# EAGLE design SysnapseWriless-BOB-v1g (EAGLE 5.10)
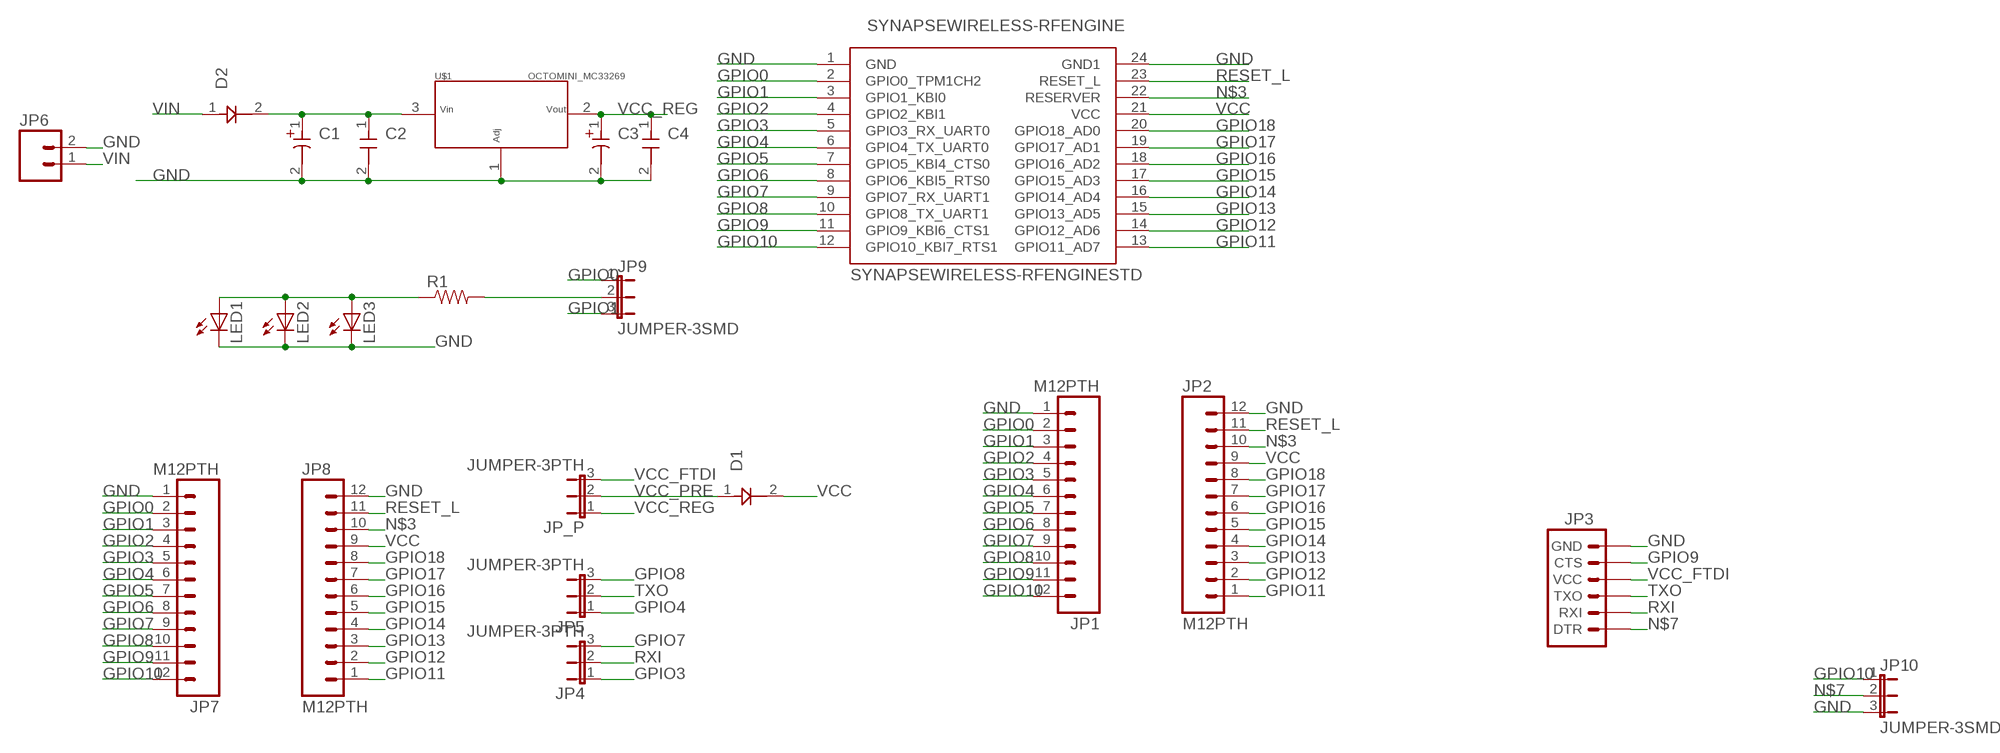
[diagram p0: schematic, sheet 1]

## Parts
C1  100uf  OCTOMINI_CAPDIELEC  [OCTOMINI_CAPDIELEC]
C2  100nf  OCTOMINI_CAPCERAM  [OCTOMINI_CAPCERAM]
C3  100uf  OCTOMINI_CAPDIELEC  [OCTOMINI_CAPDIELEC]
C4  100nf  OCTOMINI_CAPCERAM  [OCTOMINI_CAPCERAM]
D1  D1  OCTOMINI_DIODE  [OCTOMINI_DIODE]
D2  OCTOMINI_DIODE  [OCTOMINI_DIODE]
JP1  M12PTH  [1X12]
JP2  M12PTH  [1X12]
JP3  ARDUINO_SERIAL_PROGRAMPTH  [1X06]
JP4  JUMPER-3PTH  [1X03]
JP5  JUMPER-3PTH  [1X03]
JP6  M02PTH  [1X02]
JP7  M12PTH  [1X12]
JP8  M12PTH  [1X12]
JP9  JUMPER-3SMD  [SJ_3]
JP10  JUMPER-3SMD  [SJ_3]
JP_P  JUMPER-3PTH  [1X03]
LED1  LED0603  [LED-0603]
LED2  LED1206  [LED-1206]
LED3  LED3MM  [LED3MM]
R1  RESISTOR0603-RES  [0603-RES]
SYNAPSEWIRELESS-RFENGINE  SYNAPSEWIRELESS-RFENGINESTD  [SYNAPSERF100]
U$1  OCTOMINI_MC33269  [OCTOMINI_MC33269T-0.5G]

## Nets
GND: C1.2 C2.2 C3.2 C4.2 JP1.1 JP2.12 JP3.6(GND) JP6.2 JP7.1 JP8.12 JP10.3 LED1.C LED2.C LED3.K(C) SYNAPSEWIRELESS-RFENGINE.1(GND) SYNAPSEWIRELESS-RFENGINE.24(GND1) U$1.1
GPIO0: JP1.2 JP7.2 JP9.1 SYNAPSEWIRELESS-RFENGINE.2(GPIO0_TPM1CH2)
GPIO1: JP1.3 JP7.3 JP9.3 SYNAPSEWIRELESS-RFENGINE.3(GPIO1_KBI0)
GPIO2: JP1.4 JP7.4 SYNAPSEWIRELESS-RFENGINE.4(GPIO2_KBI1)
GPIO3: JP1.5 JP4.1 JP7.5 SYNAPSEWIRELESS-RFENGINE.5(GPIO3_RX_UART0)
GPIO4: JP1.6 JP5.1 JP7.6 SYNAPSEWIRELESS-RFENGINE.6(GPIO4_TX_UART0)
GPIO5: JP1.7 JP7.7 SYNAPSEWIRELESS-RFENGINE.7(GPIO5_KBI4_CTS0)
GPIO6: JP1.8 JP7.8 SYNAPSEWIRELESS-RFENGINE.8(GPIO6_KBI5_RTS0)
GPIO7: JP1.9 JP4.3 JP7.9 SYNAPSEWIRELESS-RFENGINE.9(GPIO7_RX_UART1)
GPIO8: JP1.10 JP5.3 JP7.10 SYNAPSEWIRELESS-RFENGINE.10(GPIO8_TX_UART1)
GPIO9: JP1.11 JP3.5(CTS) JP7.11 SYNAPSEWIRELESS-RFENGINE.11(GPIO9_KBI6_CTS1)
GPIO10: JP1.12 JP7.12 JP10.1 SYNAPSEWIRELESS-RFENGINE.12(GPIO10_KBI7_RTS1)
GPIO11: JP2.1 JP8.1 SYNAPSEWIRELESS-RFENGINE.13(GPIO11_AD7)
GPIO12: JP2.2 JP8.2 SYNAPSEWIRELESS-RFENGINE.14(GPIO12_AD6)
GPIO13: JP2.3 JP8.3 SYNAPSEWIRELESS-RFENGINE.15(GPIO13_AD5)
GPIO14: JP2.4 JP8.4 SYNAPSEWIRELESS-RFENGINE.16(GPIO14_AD4)
GPIO15: JP2.5 JP8.5 SYNAPSEWIRELESS-RFENGINE.17(GPIO15_AD3)
GPIO16: JP2.6 JP8.6 SYNAPSEWIRELESS-RFENGINE.18(GPIO16_AD2)
GPIO17: JP2.7 JP8.7 SYNAPSEWIRELESS-RFENGINE.19(GPIO17_AD1)
GPIO18: JP2.8 JP8.8 SYNAPSEWIRELESS-RFENGINE.20(GPIO18_AD0)
N$1: LED1.A LED2.A LED3.A R1.1
N$2: JP9.2 R1.2
N$3: JP2.10 JP8.10 SYNAPSEWIRELESS-RFENGINE.22(RESERVER)
N$7: JP3.1(DTR) JP10.2
RESET_L: JP2.11 JP8.11 SYNAPSEWIRELESS-RFENGINE.23(RESET_L)
RXI: JP3.2(RXI) JP4.2
TXO: JP3.3(TXO) JP5.2
VCC: D1.2 JP2.9 JP8.9 SYNAPSEWIRELESS-RFENGINE.21(VCC)
VCC_FTDI: JP3.4(VCC) JP_P.3
VCC_PRE: D1.1 JP_P.2
VCC_REG: C3.1 C4.1 JP_P.1 U$1.2
VIN: D2.1 JP6.1
VIN_F: C1.1 C2.1 D2.2 U$1.3

## Library data of the parts
C1 C3 = Amani_64_1d0:OCTOMINI_CAPDIELEC
C2 C4 = Amani_64_1d0:OCTOMINI_CAPCERAM
D1 D2 = Amani_64_1d0:OCTOMINI_DIODE
JP1 JP2 JP7 JP8 = SparkFun:M12: Header 12 Standard 12-pin 0.1" header. Use with straight break away headers (SKU : PRT-00116), right angle break away headers (PRT-00553), swiss pins (PRT-00743), machine pins (PRT-00117), and female headers (PRT-00115).
JP3 = SparkFun:ARDUINO_SERIAL_PROGRAM
JP4 JP5 JP9 JP10 JP_P = SparkFun:JUMPER-3
JP6 = SparkFun:M02: Header 2 Standard 2-pin 0.1" header. Use with straight break away headers (SKU : PRT-00116), right angle break away headers (PRT-00553), swiss pins (PRT-00743), machine pins (PRT-00117), and female headers (PRT-00115). Molex polarized connector foot print use with SKU : PRT-08233 with associated crimp pins and housings.
LED1-LED3 = SparkFun:LED: LEDs Standard schematic elements and footprints for 5mm, 3mm, 1206, and 0603 sized LEDs. 5mm - Spark Fun Electronics SKU : COM-00529 (and others)
R1 = SparkFun:RESISTOR: Resistor Basic schematic elements and footprints for 0603, 1206, and PTH 1/10th watt (small) resistors.
SYNAPSEWIRELESS-RFENGINE = 0_jc-custom:SYNAPSEWIRELESS-RFENGINE
U$1 = Amani_64_1d0:OCTOMINI_MC33269

## Board
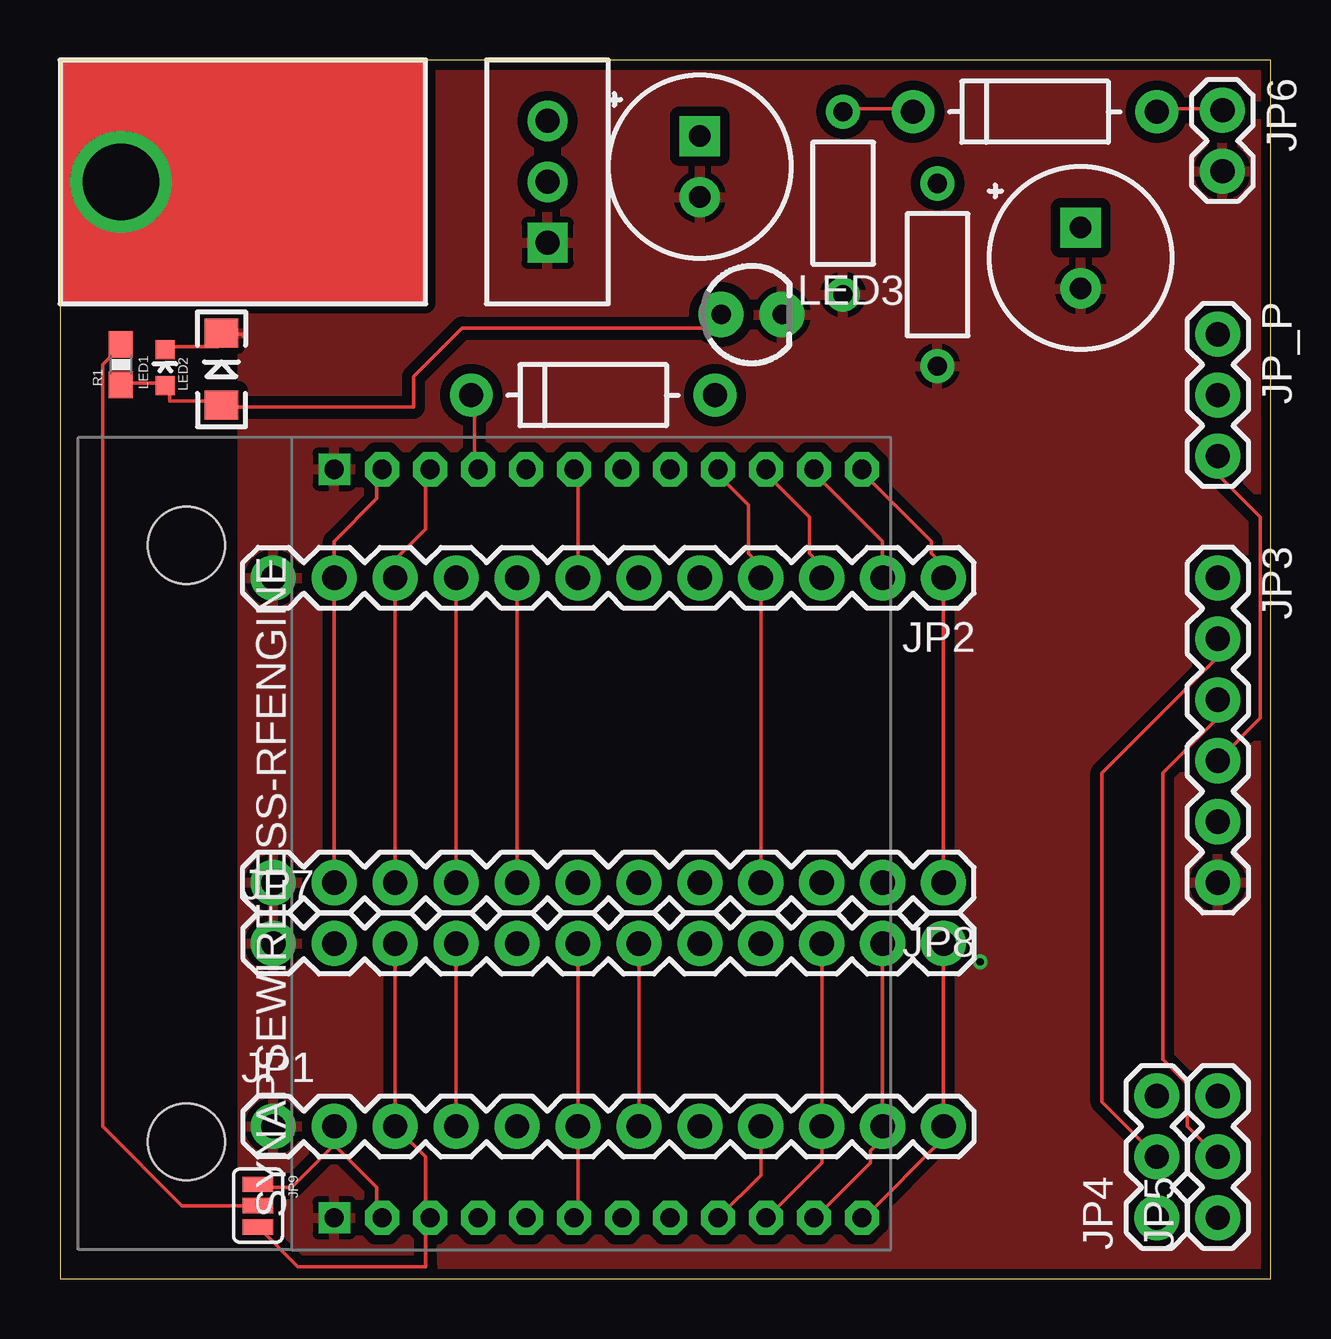
[diagram p1: board, top side]
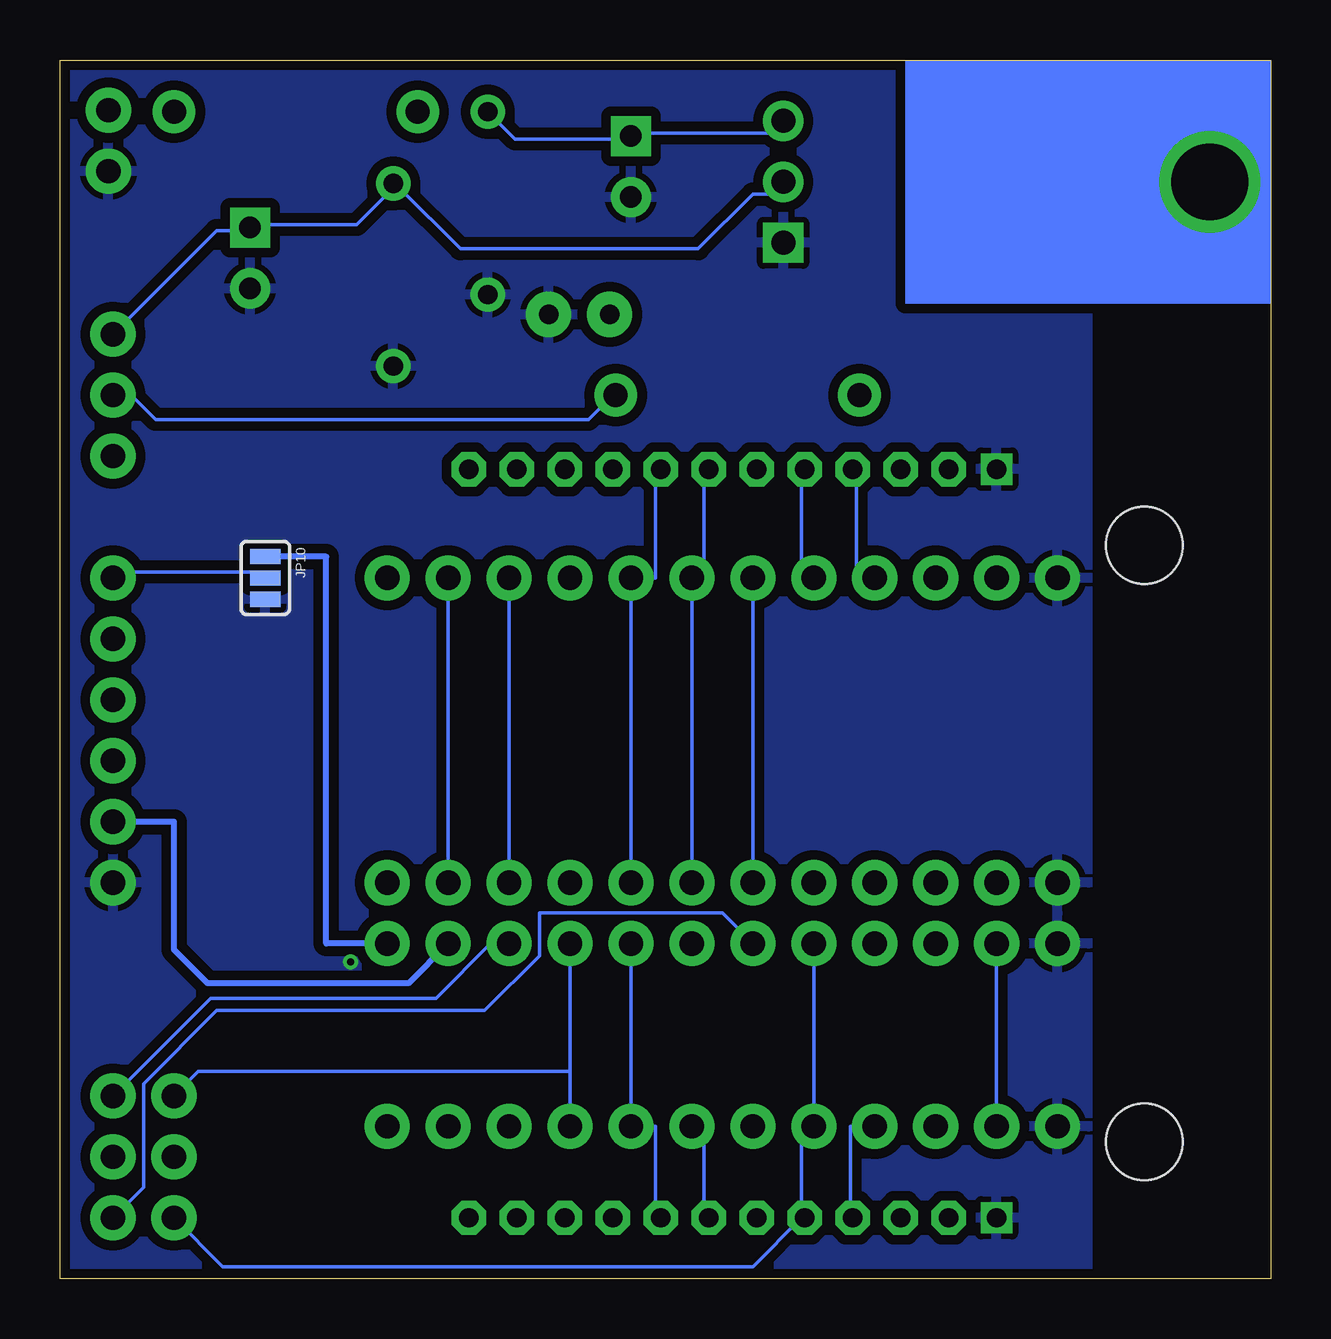
[diagram p2: board, bottom side, seen from below]

Size 50.47 x 50.79 mm. Coordinates in mm from the lower left corner, seen from the top.
Outline: 0,0 50.47,0 50.47,50.79 0,50.79 0,0
Copper layers (1*16): Top 0.035mm / dielectric 1.5mm / Bottom 0.035mm
Design rules "Fusion_eagle_rule_v1.1 *": minimum track width 6mil, minimum drill 12mil, track to track 10mil, track to pad 6mil, pad to pad 6mil, via to via 6mil, smd to smd 0mil, copper to edge 10mil, drill to drill 10mil, minimum pad ring 10mil, minimum via ring 6mil, stop-mask expansion 2mil, vias tented up to drill 100mil, thermal gap 10mil

### Footprints (pad centres in the part's own frame; a part is rotated, then mirrored left to right if it is on the bottom)
OCTOMINI_CAPDIELEC = drill 0.9 pad 1.676 square: 1 0,0 | drill 0.9 pad 1.676 round: 2 0,-2.54
OCTOMINI_CAPCERAM = drill 0.8 pad 1.422 round: 1 0,0; 2 7.62,0
OCTOMINI_DIODE = drill 1 pad 1.778 round: 1 10.16,0; 2 0,0
1X12 = drill 1.016 pad 1.88 round: 1 0,0; 2 2.54,0; 3 5.08,0; 4 7.62,0; 5 10.16,0; 6 12.7,0; 7 15.24,0; 8 17.78,0; 9 20.32,0; 10 22.86,0; 11 25.4,0; 12 27.94,0
1X06 = drill 1.016 pad 1.88 round: 1 0,0; 2 2.54,0; 3 5.08,0; 4 7.62,0; 5 10.16,0; 6 12.7,0
1X03 = drill 1.016 pad 1.88 round: 1 0,0; 2 2.54,0; 3 5.08,0
1X02 = drill 1.016 pad 1.88 round: 1 0,0; 2 2.54,0
SJ_3 = smd 0.635 x 1.27: 1 -0.889,0; 2 0,0; 3 0.889,0
LED-0603 = smd 0.8 x 0.8: A 0,-0.75; C 0,0.75
LED-1206 = smd 1.2 x 1.4: A -1.5,0; C 1.5,0
LED3MM = drill 0.813 pad 1.88 round: A -1.27,0; K 1.27,0
0603-RES = smd 1.1 x 1: 1 -0.85,0; 2 0.85,0
SYNAPSERF100 = drill 0.8 square: 1 0,0; 24 31.2,0 | drill 0.8 pad 1.422 octagon: 2 0,-2; 3 0,-4; 4 0,-6; 5 0,-8; 6 0,-10; 7 0,-12; 8 0,-14; 9 0,-16; 10 0,-18; 11 0,-20; 12 0,-22; 13 31.2,-22; 14 31.2,-20; 15 31.2,-18; 16 31.2,-16; 17 31.2,-14; 18 31.2,-12; 19 31.2,-10; 20 31.2,-8; 21 31.2,-6; 22 31.2,-4; 23 31.2,-2 | hole 3.2: 3.17,6.16; 28.03,6.16
OCTOMINI_MC33269T-0.5G = drill 1 pad 1.676 square: 1 0,0 | drill 1 pad 1.676 round: 2 2.54,0; 3 5.08,0 | drill 3.2 pad 3.81 round: P$1 2.54,17.78

### Placement (x,y rotation side)
C1  26.67,47.62 0 top
C2  32.64,48.64 270 top
C3  42.55,43.81 0 top
C4  36.58,45.66 270 top
D1  17.14,36.83 0 top
D2  35.56,48.64 0 top
JP1  8.89,6.35 0 top
JP2  36.83,29.21 180 top
JP3  48.26,29.21 270 top
JP4  45.72,2.54 90 top
JP5  48.26,2.54 90 top
JP6  48.45,48.7 270 top
JP7  8.89,13.97 0 top
JP8  36.83,16.51 180 top
JP9  8.26,3.05 270 top
JP10  41.91,29.21 270 bottom
JP_P  48.26,39.37 270 top
LED1  4.38,37.97 0 top
LED2  6.73,37.91 90 top
LED3  28.83,40.2 0 top
R1  2.54,38.1 90 top
SYNAPSEWIRELESS-RFENGINE  11.43,2.54 90 top
U$1  20.32,43.18 90 top

### Tracks (layer width: path | path; a pad name or v marks a point on that pad's centre or on a via)
GND  (via drill 0.3)
  Top 0.152: LED1.C 4.57,38.86 6.6,38.86 6.6,39.37 LED2.C 6.86,39.37 7.62,39.37 7.62,39.31
  other vias: 38.35,13.21
  pour Bottom (isolate 0.406): 7.62,50.8 50.8,50.8 50.8,0 7.62,0
  pour Top (isolate 0.406): 7.62,50.8 50.8,50.8 50.8,0 7.62,0
GPIO0
  Top 0.152: 11.43,5.59 9.65,3.81 8.38,3.81 JP9.1 | 11.43,5.59 13.21,3.81 13.21,2.54 SYNAPSEWIRELESS-RFENGINE.2 | 11.43,5.59 JP1.2
  Bottom 0.152: JP1.2 JP7.2
GPIO1
  Top 0.152: 15.24,2.54 15.24,0.51 9.91,0.51 JP9.3 | 15.24,2.54 15.24,5.08 JP1.3 JP7.3 | 15.24,2.54 SYNAPSEWIRELESS-RFENGINE.3
GPIO2
  Top 0.152: JP1.4 JP7.4
  Bottom 0.152: JP1.4 17.53,6.35 17.53,2.54 SYNAPSEWIRELESS-RFENGINE.4
GPIO3
  Bottom 0.152: 19.56,2.54 19.56,6.35 JP1.5 JP7.5 | JP4.1 43.69,0.51 21.59,0.51 19.56,2.54 | SYNAPSEWIRELESS-RFENGINE.5 19.56,2.54
GPIO4
  Top 0.152: SYNAPSEWIRELESS-RFENGINE.6 21.59,2.54 JP1.6 JP7.6
  Bottom 0.152: JP5.1 46.99,3.81 46.99,8.13 43.94,11.18 32.77,11.18 30.48,13.46 30.48,15.24 22.86,15.24 JP7.6
GPIO5
  Top 0.152: JP1.7 JP7.7
  Bottom 0.152: JP1.7 23.62,6.35 23.62,2.54 SYNAPSEWIRELESS-RFENGINE.7
GPIO6
  Bottom 0.152: SYNAPSEWIRELESS-RFENGINE.8 25.65,2.54 25.65,6.35 JP1.8 JP7.8
GPIO7
  Top 0.152: JP1.9 29.21,4.32 SYNAPSEWIRELESS-RFENGINE.9
  Bottom 0.152: JP1.9 29.21,8.64 | 29.21,8.64 JP7.9 | JP4.3 44.7,8.64 29.21,8.64
GPIO8
  Top 0.152: SYNAPSEWIRELESS-RFENGINE.10 29.46,2.54 31.75,4.83 JP1.10 JP7.10
  Bottom 0.152: JP5.3 44.2,11.68 34.8,11.68 32.51,13.97 JP7.10
GPIO9
  Top 0.152: SYNAPSEWIRELESS-RFENGINE.11 31.5,2.54 33.78,4.83 33.78,5.33 34.29,5.84 JP1.11 JP7.11
  Bottom 0.254: JP7.11 35.94,12.32 44.32,12.32 45.72,13.72 45.72,19.05 JP3.5
GPIO10
  Top 0.152: SYNAPSEWIRELESS-RFENGINE.12 33.53,2.54 36.83,5.84 JP1.12 JP7.12
  Bottom 0.254: JP10.1 39.37,30.1 39.37,13.97 JP7.12
GPIO11
  Top 0.152: SYNAPSEWIRELESS-RFENGINE.13 33.53,33.53 36.32,30.73 36.32,30.23 36.83,29.72 JP2.1 JP8.1
GPIO12
  Top 0.152: JP2.2 34.29,30.73 31.5,33.53 SYNAPSEWIRELESS-RFENGINE.14
  Bottom 0.152: JP8.2 JP2.2
GPIO13
  Top 0.152: JP2.3 31.75,29.72 31.24,30.23 31.24,31.75 29.46,33.53 SYNAPSEWIRELESS-RFENGINE.15
  Bottom 0.152: JP8.3 JP2.3
GPIO14
  Top 0.152: SYNAPSEWIRELESS-RFENGINE.16 27.43,33.53 28.7,32.26 28.7,30.23 29.21,29.72 JP2.4 JP8.4
GPIO15
  Bottom 0.152: SYNAPSEWIRELESS-RFENGINE.17 25.65,33.53 25.65,29.21 JP2.5 JP8.5
GPIO16
  Bottom 0.152: SYNAPSEWIRELESS-RFENGINE.18 23.62,33.53 23.62,29.21 JP2.6 JP8.6
GPIO17
  Top 0.152: JP2.7 21.59,33.53 SYNAPSEWIRELESS-RFENGINE.19
  Bottom 0.152: JP8.7 JP2.7
GPIO18
  Top 0.152: JP8.8 JP2.8
  Bottom 0.152: JP2.8 19.56,29.21 19.56,33.53 SYNAPSEWIRELESS-RFENGINE.20
N$1
  Top 0.152: R1.1 2.54,37.34 4.32,37.34 LED1.A 4.57,37.08 4.57,36.58 6.6,36.58 LED2.A 6.86,36.32 14.73,36.32 14.73,37.59 16.76,39.62 27.43,39.62 27.43,40.13 LED3.A
N$2
  Top 0.152: R1.2 2.54,38.86 1.78,38.1 1.78,6.35 5.08,3.05 JP9.2
N$3
  Top 0.152: SYNAPSEWIRELESS-RFENGINE.22 15.24,33.53 15.24,31.24 13.97,29.97 JP2.10 JP8.10
N$7
  Bottom 0.152: JP10.2 42.16,29.46 48.01,29.46 JP3.1
RESET_L
  Top 0.152: SYNAPSEWIRELESS-RFENGINE.23 13.21,33.53 13.21,32.51 11.43,30.73 JP2.11 JP8.11
RXI
  Top 0.152: JP4.2 43.43,7.37 43.43,21.08 48.26,25.91 JP3.2
TXO
  Top 0.152: JP5.2 46.99,6.35 46.99,8.13 45.97,9.14 45.97,21.08 48.26,23.37 JP3.3
VCC
  Top 0.152: SYNAPSEWIRELESS-RFENGINE.21 17.27,33.78 17.27,36.83 D1.2 | JP8.9 JP2.9
  Bottom 0.152: JP2.9 17.27,29.21 17.27,33.53 SYNAPSEWIRELESS-RFENGINE.21
VCC_FTDI
  Top 0.152: JP3.4 50.04,23.37 50.04,31.75 48.26,33.53 JP_P.3
VCC_PRE
  Bottom 0.152: JP_P.2 47.5,36.83 46.48,35.81 28.45,35.81 27.43,36.83 D1.1
VCC_REG
  Bottom 0.152: 36.58,45.47 38.1,43.94 42.42,43.94 C3.1 42.67,43.69 43.94,43.69 JP_P.1 | U$1.2 20.83,45.21 21.59,45.21 23.88,42.93 33.78,42.93 36.32,45.47 36.58,45.47 | 36.58,45.47 C4.1
VIN
  Top 0.152: D2.1 45.72,48.77 48.26,48.77 JP6.1
VIN_F
  Top 0.152: C2.1 32.77,48.77 35.56,48.77 D2.2
  Bottom 0.152: U$1.3 20.83,47.75 26.67,47.75 C1.1 26.67,47.5 31.5,47.5 C2.1

### Text on the board
tDocu: + | D2 | C1 | C2 | C3 | C4 | VREG | VCC | D1 | FTDI | RXI | TXO | VCC | CTS | GND | Synapse-BOB Rev1f | RX | TX | 1 | UART | 0
bDocu: + | VIN | 20100928 | 2.7-3.4 | GND | RESET_L | PTG0/BKDG | VCC | GPIO18_AD0 | GPIO17_AD1 | GPIO16_AD2 | GPIO15_AD3 | GPIO14_AD4 | GPIO13_AD5 | GPIO12_AD6 | GPIO11_AD7 | GND | GPIO0 | GPIO1 | GPIO2 | RX0 | TX0 | 5_CTS0 | 6_RTS0 | 7_RX1 | 8_TX1 | 9_CTS1 | 10_RTS1 | J.C. Woltz